# EAGLE design vvcc (EAGLE 9.6.2)

## Sheet 1 of 2
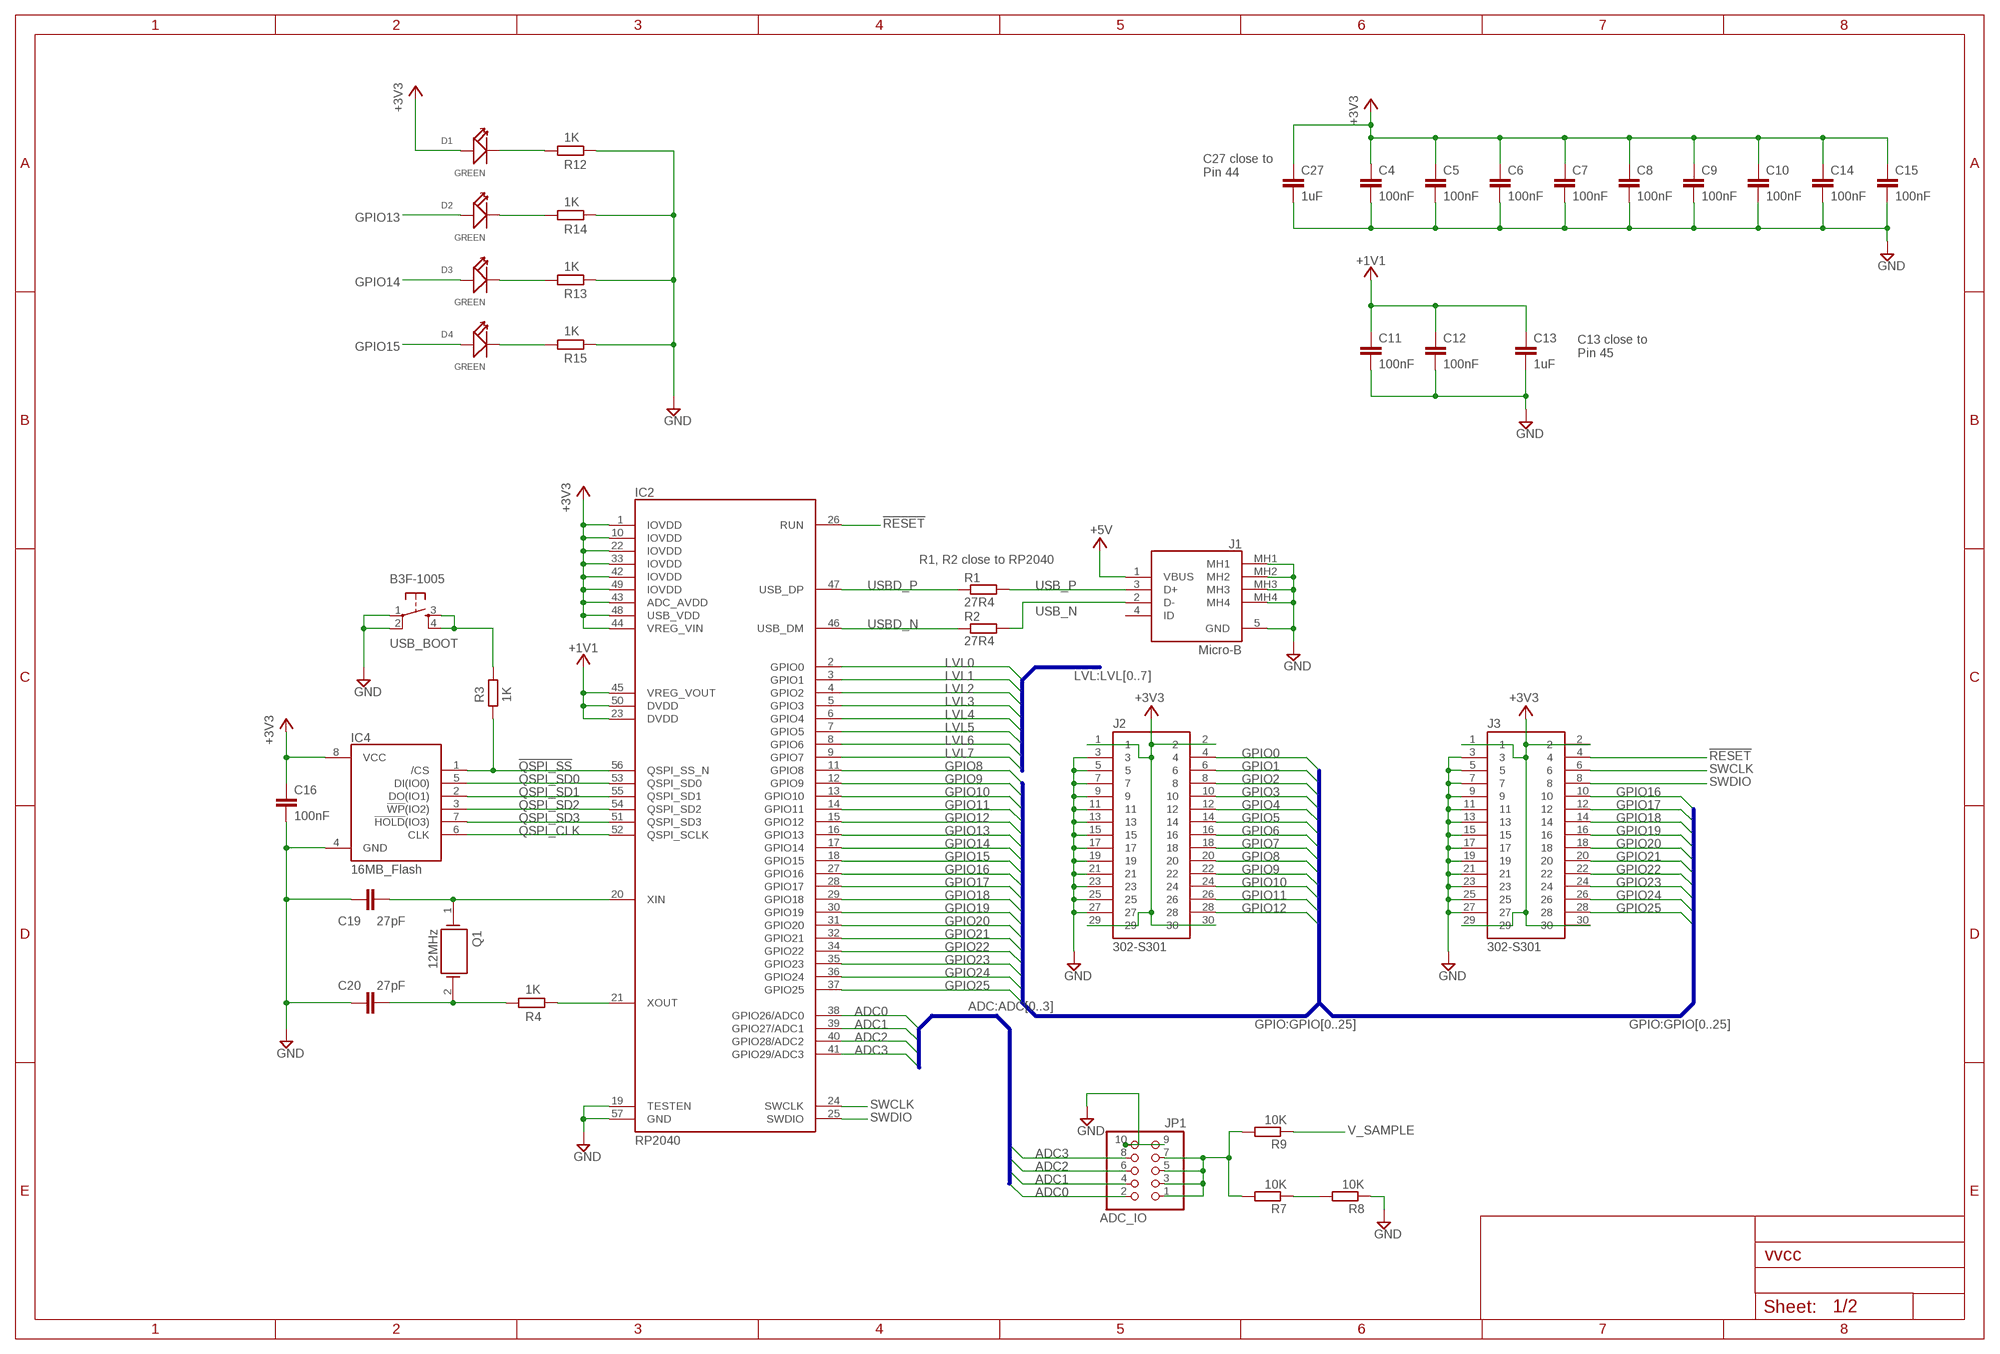
[diagram p0: schematic, sheet 1]

### Parts
C4  100nF  C-EUC0201  [C0201]
C5  100nF  C-EUC0201  [C0201]
C6  100nF  C-EUC0201  [C0201]
C7  100nF  C-EUC0201  [C0201]
C8  100nF  C-EUC0201  [C0201]
C9  100nF  C-EUC0201  [C0201]
C10  100nF  C-EUC0201  [C0201]
C11  100nF  C-EUC0201  [C0201]
C12  100nF  C-EUC0201  [C0201]
C13  1uF  C-EUC0201  [C0201]
C14  100nF  C-EUC0201  [C0201]
C15  100nF  C-EUC0201  [C0201]
C16  100nF  C-EUC0201  [C0201]
C19  27pF  C-EUC0201  [C0201]
C20  27pF  C-EUC0201  [C0201]
C27  1uF  C-EUC0201  [C0201]
D1  GREEN  SMD-LED-CLEAR-BLUE(0603)  [LED-0603]
D2  GREEN  SMD-LED-CLEAR-BLUE(0603)  [LED-0603]
D3  GREEN  SMD-LED-CLEAR-BLUE(0603)  [LED-0603]
D4  GREEN  SMD-LED-CLEAR-BLUE(0603)  [LED-0603]
IC2  RP2040  [QFN40P700X700X90-57N]
IC4  16MB_Flash  W25Q128JVSIM_TR  [SOIC127P790X216-8N]
J1  Micro-B  MCR-B-S-RA-SMT-CS14-T_R  [MCRBSRASMTCS14TR]
J2  302-S301  [SHDR30W66P254_2X15_4572X910X91]
J3  302-S301  [SHDR30W66P254_2X15_4572X910X91]
JP1  ADC_IO  PINHD-2X5  [2X05]
Q1  12MHz  ABLS-12.000MHZ-B4-T  [HC/49US-(AT49)_1]
R1  27R4  R-EU_R0201  [R0201]
R2  27R4  R-EU_R0201  [R0201]
R3  1K  R-EU_R0201  [R0201]
R4  1K  R-EU_R0201  [R0201]
R7  10K  R-EU_R0201  [R0201]
R8  10K  R-EU_R0201  [R0201]
R9  10K  R-EU_R0201  [R0201]
R12  1K  R-EU_R0201  [R0201]
R13  1K  R-EU_R0201  [R0201]
R14  1K  R-EU_R0201  [R0201]
R15  1K  R-EU_R0201  [R0201]
USB_BOOT  B3F-1005  TAC_SWITCHPTH  [TACTILE-PTH]

### Nets
!QSPI_SS!: IC2.56(QSPI_SS_N) IC4.1(/CS) R3.2
!RESET!: IC2.26(RUN) J3.4 ; also sheet 2
+1.8_FT: C11.1 C12.1 C13.1 IC2.23(DVDD) IC2.45(VREG_VOUT) IC2.50(DVDD) ; supply symbol labelled +1V1
+3V3: C4.1 C5.1 C6.1 C7.1 C8.1 C9.1 C10.1 C14.1 C15.1 C16.1 C27.1 D1.+ IC2.1(IOVDD) IC2.10(IOVDD) IC2.22(IOVDD) IC2.33(IOVDD) IC2.42(IOVDD) IC2.43(ADC_AVDD) IC2.44(VREG_VIN) IC2.48(USB_VDD) IC2.49(IOVDD) IC4.8(VCC) J2.1 J2.2 J2.29 J2.30 J3.1 J3.2 J3.29 J3.30 ; also sheet 2
+5V: J1.1(VBUS) ; also sheet 2
ADC0: IC2.38(GPIO26/ADC0) JP1.2
ADC1: IC2.39(GPIO27/ADC1) JP1.4
ADC2: IC2.40(GPIO28/ADC2) JP1.6
ADC3: IC2.41(GPIO29/ADC3) JP1.8
GND: C4.2 C5.2 C6.2 C7.2 C8.2 C9.2 C10.2 C11.2 C12.2 C13.2 C14.2 C15.2 C16.2 C19.2 C20.1 C27.2 IC2.19(TESTEN) IC2.57(GND) IC4.4(GND) J1.5(GND) J1.MH1 J1.MH2 J1.MH3 J1.MH4 J2.3 J2.5 J2.7 J2.9 J2.11 J2.13 J2.15 J2.17 J2.19 J2.21 J2.23 J2.25 J2.27 J3.3 J3.5 J3.7 J3.9 J3.11 J3.13 J3.15 J3.17 J3.19 J3.21 J3.23 J3.25 J3.27 JP1.9 JP1.10 R8.1 R12.2 R13.2 R14.2 R15.2 USB_BOOT.1 USB_BOOT.2 ; also sheet 2
GPIO0: J2.4 ; also sheet 2
GPIO1: J2.6 ; also sheet 2
GPIO2: J2.8 ; also sheet 2
GPIO3: J2.10 ; also sheet 2
GPIO4: J2.12 ; also sheet 2
GPIO5: J2.14 ; also sheet 2
GPIO6: J2.16 ; also sheet 2
GPIO7: J2.18 ; also sheet 2
GPIO8: IC2.11(GPIO8) J2.20 ; also sheet 2
GPIO9: IC2.12(GPIO9) J2.22 ; also sheet 2
GPIO10: IC2.13(GPIO10) J2.24
GPIO11: IC2.14(GPIO11) J2.26
GPIO12: IC2.15(GPIO12) J2.28 ; also sheet 2
GPIO13: D2.+ IC2.16(GPIO13) ; also sheet 2
GPIO14: D3.+ IC2.17(GPIO14)
GPIO15: D4.+ IC2.18(GPIO15)
GPIO16: IC2.27(GPIO16) J3.10
GPIO17: IC2.28(GPIO17) J3.12
GPIO18: IC2.29(GPIO18) J3.14
GPIO19: IC2.30(GPIO19) J3.16
GPIO20: IC2.31(GPIO20) J3.18
GPIO21: IC2.32(GPIO21) J3.20
GPIO22: IC2.34(GPIO22) J3.22
GPIO23: IC2.35(GPIO23) J3.24
GPIO24: IC2.36(GPIO24) J3.26
GPIO25: IC2.37(GPIO25) J3.28
LVL0: IC2.2(GPIO0) ; also sheet 2
LVL1: IC2.3(GPIO1) ; also sheet 2
LVL2: IC2.4(GPIO2) ; also sheet 2
LVL3: IC2.5(GPIO3) ; also sheet 2
LVL4: IC2.6(GPIO4) ; also sheet 2
LVL5: IC2.7(GPIO5) ; also sheet 2
LVL6: IC2.8(GPIO6) ; also sheet 2
LVL7: IC2.9(GPIO7) ; also sheet 2
N$1: C19.1 IC2.20(XIN) Q1.1
N$2: C20.2 Q1.2 R4.1
N$3: D1.- R12.1
N$4: D2.- R14.1
N$5: R3.1 USB_BOOT.3 USB_BOOT.4
N$6: D3.- R13.1
N$7: IC2.21(XOUT) R4.2
N$8: D4.- R15.1
N$9: JP1.1 JP1.3 JP1.5 JP1.7 R7.2 R9.2
N$11: R7.1 R8.2
QSPI_CLK: IC2.52(QSPI_SCLK) IC4.6(CLK)
QSPI_SD0: IC2.53(QSPI_SD0) IC4.5(DI(IO0))
QSPI_SD1: IC2.55(QSPI_SD1) IC4.2(DO(IO1))
QSPI_SD2: IC2.54(QSPI_SD2) IC4.3(!WP!(IO2))
QSPI_SD3: IC2.51(QSPI_SD3) IC4.7(!HOLD!(IO3))
SWCLK: IC2.24(SWCLK) J3.6
SWDIO: IC2.25(SWDIO) J3.8
USB_N [USB]: J1.2(D-) R2.2
USB_P [USB]: J1.3(D+) R1.2
USBD_N: IC2.46(USB_DM) R2.1
USBD_P: IC2.47(USB_DP) R1.1
V_SAMPLE: R9.1 ; also sheet 2
Unconnected: J1.4(ID)

### Buses
GPIO:GPIO[0..25]
ADC:ADC[0..3]
LVL:LVL[0..7]

### Notes on the sheet
- C27 close to
  Pin 44
- C13 close to
  Pin 45
- R1, R2 close to RP2040

## Sheet 2 of 2
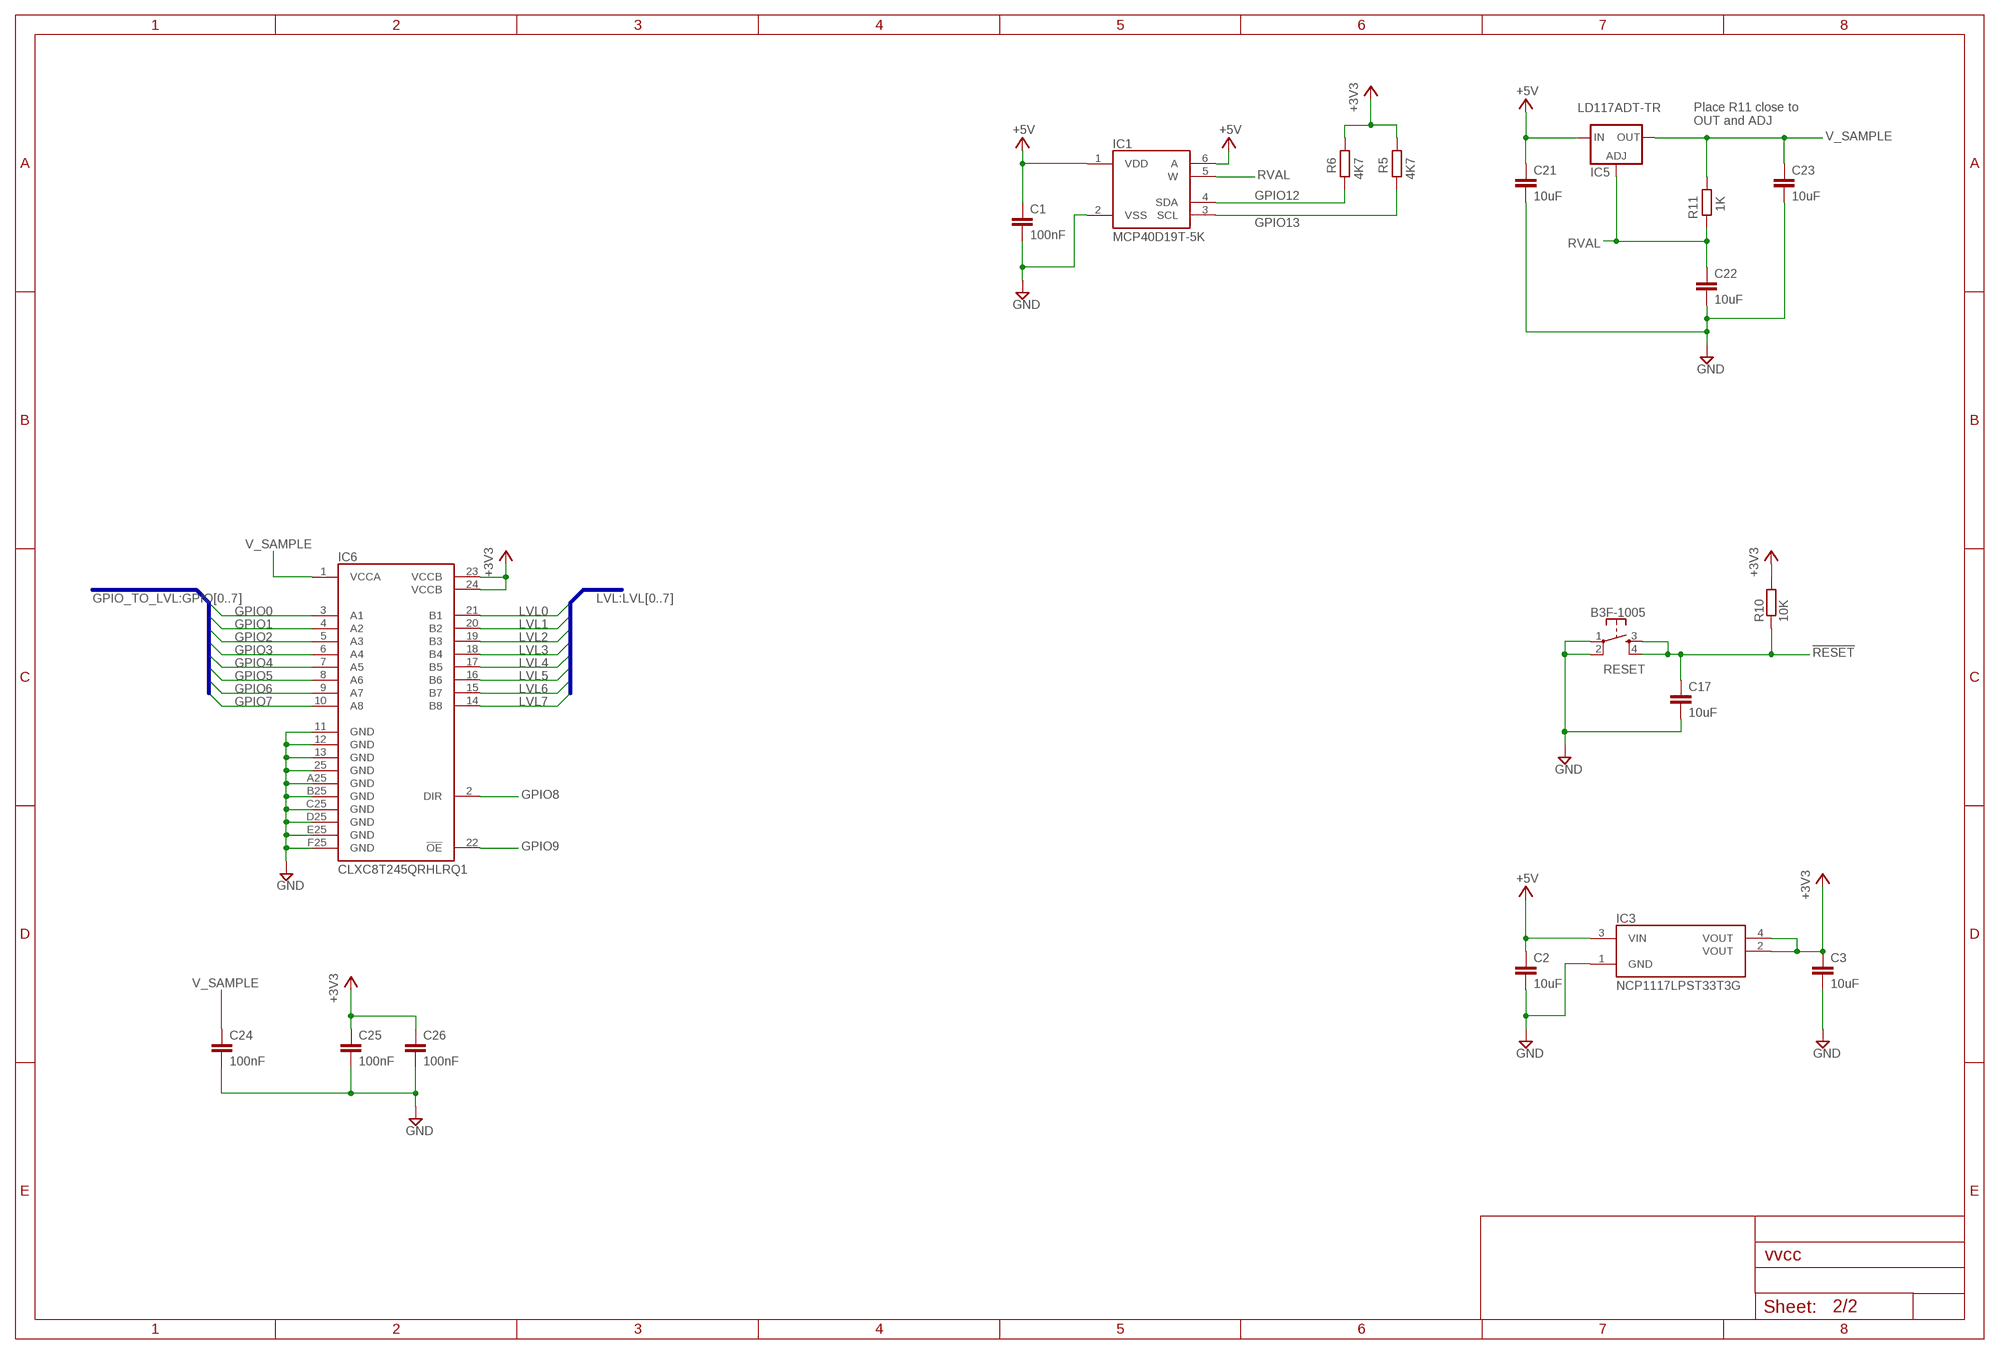
[diagram p1: schematic, sheet 2]

### Parts
C1  100nF  C-EUC0201  [C0201]
C2  10uF  C-EUC0402  [C0402]
C3  10uF  C-EUC0402  [C0402]
C17  10uF  C-EUC0402  [C0402]
C21  10uF  C-EUC0402  [C0402]
C22  10uF  C-EUC0402  [C0402]
C23  10uF  C-EUC0402  [C0402]
C24  100nF  C-EUC0201  [C0201]
C25  100nF  C-EUC0201  [C0201]
C26  100nF  C-EUC0201  [C0201]
IC1  MCP40D19T-5K  MCP40D18T-104E_LT  [SOP65P210X110-6N]
IC3  NCP1117LPST33T3G  [SOT230P700X180-4N]
IC5  LD117ADT-TR  [DPACK]
IC6  CLXC8T245QRHLRQ1  [CLXC8T245QRHLRQ1]
R5  4K7  R-EU_R0201  [R0201]
R6  4K7  R-EU_R0201  [R0201]
R10  10K  R-EU_R0201  [R0201]
R11  1K  R-EU_R0201  [R0201]
RESET  B3F-1005  TAC_SWITCHPTH  [TACTILE-PTH]

### Nets
!RESET!: C17.1 R10.1 RESET.3 RESET.4 ; also sheet 1
+3V3: C3.1 C25.1 C26.1 IC3.2(VOUT) IC3.4(VOUT) IC6.23(VCCB) IC6.24(VCCB) R5.1 R6.1 R10.2 ; also sheet 1
+5V: C1.1 C2.1 C21.1 IC1.1(VDD) IC1.6(A) IC3.3(VIN) IC5.3(IN) ; also sheet 1
GND: C1.2 C2.2 C3.2 C17.2 C21.2 C22.2 C23.2 C24.2 C25.2 C26.2 IC1.2(VSS) IC3.1(GND) IC6.11(GND) IC6.12(GND) IC6.13(GND) IC6.25(GND) IC6.A25(GND) IC6.B25(GND) IC6.C25(GND) IC6.D25(GND) IC6.E25(GND) IC6.F25(GND) RESET.1 RESET.2 ; also sheet 1
GPIO0: IC6.3(A1) ; also sheet 1
GPIO1: IC6.4(A2) ; also sheet 1
GPIO2: IC6.5(A3) ; also sheet 1
GPIO3: IC6.6(A4) ; also sheet 1
GPIO4: IC6.7(A5) ; also sheet 1
GPIO5: IC6.8(A6) ; also sheet 1
GPIO6: IC6.9(A7) ; also sheet 1
GPIO7: IC6.10(A8) ; also sheet 1
GPIO8: IC6.2(DIR) ; also sheet 1
GPIO9: IC6.22(!OE) ; also sheet 1
GPIO12: IC1.4(SDA) R6.2 ; also sheet 1
GPIO13: IC1.3(SCL) R5.2 ; also sheet 1
LVL0: IC6.21(B1) ; also sheet 1
LVL1: IC6.20(B2) ; also sheet 1
LVL2: IC6.19(B3) ; also sheet 1
LVL3: IC6.18(B4) ; also sheet 1
LVL4: IC6.17(B5) ; also sheet 1
LVL5: IC6.16(B6) ; also sheet 1
LVL6: IC6.15(B7) ; also sheet 1
LVL7: IC6.14(B8) ; also sheet 1
RVAL: C22.1 IC1.5(W) IC5.1(ADJ) R11.2
V_SAMPLE: C23.1 C24.1 IC5.4(OUT) IC6.1(VCCA) R11.1 ; also sheet 1

### Buses
GPIO_TO_LVL:GPIO[0..7]
LVL:LVL[0..7]

### Notes on the sheet
- Place R11 close to
  OUT and ADJ

## Library data of the parts
C1 C4-C12 C14-C16 C24-C26 = rcl:C-EU: CAPACITOR, European symbol; SPICEPREFIX: C; USE: 0201X104M160CT
C2 C3 C17 C21-C23 = rcl:C-EU: CAPACITOR, European symbol; SPICEPREFIX: C; USE: GRM155R60J106ME15D
C13 C27 = rcl:C-EU: CAPACITOR, European symbol; SPICEPREFIX: C; USE: 0201B102K250CT
C19 C20 = rcl:C-EU: CAPACITOR, European symbol; SPICEPREFIX: C; USE: C0201C270J3GAC7867
D1-D4 = Seeed-LED:SMD-LED-CLEAR-BLUE(0603): 304090045; MPN: 19-217-BHC-ZL1M2RY-3T; USE: B1931NG--20D001114U1930; VALUE: BLUE-0603
IC1 = samacsys:MCP40D18T-104E_LT: MCP40D18T-104E/LT, Digital Potentiometer 100k 128-Position Linear Serial-I2C 6-Pin SC-70 Source: Datasheet <https://componentsearchengine.com/Datasheets/2/MCP40D18T-104E_LT.pdf>; ARROW_PART_NUMBER: MCP40D18T-104E/LT; ARROW_PRICE-STOCK: https://www.arrow.com/en/products/mcp40d18t-104elt/microchip-technology?region=nac; DESCRIPTION: MCP40D18T-104E/LT, Digital Potentiometer 100k 128-Position Linear Serial-I2C 6-Pin SC-70; HEIGHT: 1.1mm; MANUFACTURER_NAME: Microchip; MANUFACTURER_PART_NUMBER: MCP40D18T-104E/LT; MOUSER_PART_NUMBER: 579-MCP40D18T104E/LT; MOUSER_PRICE-STOCK: https://www.mouser.co.uk/ProductDetail/Microchip-Technology/MCP40D18T-104E-LT?qs=dQMF8gqycOWA9kQDYIYtyg%3D%3D; USE: MCP4019T-502E/LT
IC2 = samacsys:RP2040: Microcontroller in QFN Package Source: Datasheet <https://datasheets.raspberrypi.org/rp2040/rp2040-datasheet.pdf>; DESCRIPTION: Microcontroller in QFN Package; HEIGHT: 0.9mm; MANUFACTURER_NAME: RASPBERRY-PI; MANUFACTURER_PART_NUMBER: RP2040; USE: SC0914(13)
IC3 = samacsys:NCP1117LPST33T3G: ON SEMICONDUCTOR - NCP1117LPST33T3G - Fixed LDO Voltage Regulator, 18V in, 1.3V Dropout, 3.3V/1A out, SOT-223-3 Source: Datasheet <http://www.onsemi.com/pub/Collateral/NCP1117LP-D.PDF>; ARROW_PART_NUMBER: NCP1117LPST33T3G; ARROW_PRICE-STOCK: https://www.arrow.com/en/products/ncp1117lpst33t3g/on-semiconductor?region=nac; DESCRIPTION: ON SEMICONDUCTOR - NCP1117LPST33T3G - Fixed LDO Voltage Regulator, 18V in, 1.3V Dropout, 3.3V/1A out, SOT-223-3; HEIGHT: 1.8mm; MANUFACTURER_NAME: ON Semiconductor; MANUFACTURER_PART_NUMBER: NCP1117LPST33T3G; MOUSER_PART_NUMBER: 863-NCP1117LPST33T3G; MOUSER_PRICE-STOCK: https://www.mouser.co.uk/ProductDetail/onsemi/NCP1117LPST33T3G?qs=kbSN2QblFfKG9A4Foh4YYg%3D%3D; USE: NCP1117LPST33T3G
IC4 = samacsys:W25Q128JVSIM_TR: 3V 128M-BIT SERIAL FLASH MEMORY WITH DUAL/QUAD SPI & QPI & DTR Source: Datasheet <http://www.winbond.com/resource-files/w25q128jv dtr revb 11042016.pdf>; ARROW_PART_NUMBER: W25Q128JVSIM TR; ARROW_PRICE-STOCK: https://www.arrow.com/en/products/w25q128jvsimtr/winbond-electronics?region=nac; DESCRIPTION: 3V 128M-BIT SERIAL FLASH MEMORY WITH DUAL/QUAD SPI & QPI & DTR; HEIGHT: 2.16mm; MANUFACTURER_NAME: Winbond; MANUFACTURER_PART_NUMBER: W25Q128JVSIM TR; MOUSER_PART_NUMBER: 454-W25Q128JVSIMTR; MOUSER_PRICE-STOCK: https://www.mouser.co.uk/ProductDetail/Winbond/W25Q128JVSIM-TR?qs=qSfuJ%252Bfl%2Fd6ji9IuruL6Zg%3D%3D; USE: W25Q128JVSIM
IC5 = v-reg:LD117A?*: Low drop fixed and adjustable positive voltage regulators 1 A Source: http://www.st.com/stonline/products/literature/ds/7194/ld1117axx.pdf; USE: LD1117ADT-TR
IC6 = samacsys:CLXC8T245QRHLRQ1: Translation - Voltage Levels Automotive 8-bit dual-supply wide voltage level translating transceiver with tri-state output Source: Datasheet <https://www.ti.com/lit/ds/symlink/sn74lxc8t245-q1.pdf?ts=1613201124833&ref_url=https%3A%2F%2Fwww.ti.com%2Fproduct%2FSN74LXC8T245-Q1>; ARROW_PART_NUMBER: CLXC8T245QRHLRQ1; ARROW_PRICE-STOCK: https://www.arrow.com/en/products/clxc8t245qrhlrq1/texas-instruments?region=nac; DESCRIPTION: Translation - Voltage Levels Automotive 8-bit dual-supply wide voltage level translating transceiver with tri-state output; HEIGHT: 1mm; MANUFACTURER_NAME: Texas Instruments; MANUFACTURER_PART_NUMBER: CLXC8T245QRHLRQ1; MOUSER_PART_NUMBER: 595-CLXC8T245QRHLRQ1; MOUSER_PRICE-STOCK: https://www.mouser.co.uk/ProductDetail/Texas-Instruments/CLXC8T245QRHLRQ1?qs=81r%252BiQLm7BTun0cHFvM3vA%3D%3D; USE: CLXC8T245QRHLRQ1
J1 = samacsys:MCR-B-S-RA-SMT-CS14-T_R: USB - micro B Receptacle Connector 5 Position Surface Mount, Right Angle Source: Datasheet <https://app.adam-tech.com/products/download/data_sheet/195344/mcr-b-s-ra-smt-cs14-t-r-data-sheet.pdf>; ARROW_PART_NUMBER: MCR-B-S-RA-SMT-CS14-T/R; ARROW_PRICE-STOCK: https://www.arrow.com/en/products/mcr-b-s-ra-smt-cs14-tr/adam-tech?region=nac; DESCRIPTION: USB - micro B Receptacle Connector 5 Position Surface Mount, Right Angle; HEIGHT: 3.1mm; MANUFACTURER_NAME: Adam Tech; MANUFACTURER_PART_NUMBER: MCR-B-S-RA-SMT-CS14-T/R; USE: MCR-B-S-RA-SMT-CS14-T_R
J2 J3 = samacsys:302-S301: Dual row vertical box header Source: Datasheet <https://datasheet.datasheetarchive.com/originals/dk/DKDS-18/336341.pdf>; ARROW_PART_NUMBER: 302-S301; ARROW_PRICE-STOCK: https://www.arrow.com/en/products/302-s301/on-shore-technology; DESCRIPTION: Dual row vertical box header; HEIGHT: 9.1mm; MANUFACTURER_NAME: On-Shore Technology, Inc; MANUFACTURER_PART_NUMBER: 302-S301; USE: 302-S301
JP1 = pinhead:PINHD-2X5: PIN HEADER; USE: PR20205VBDN
Q1 = samacsys:ABLS-12.000MHZ-B4-T: ABRACON - ABLS-12.000MHZ-B4-T - CRYSTAL, 12MHZ, 18PF, HC-49US Source: Datasheet <https://componentsearchengine.com/Datasheets/2/ABLS-12.000MHZ-B4-T.pdf>; ARROW_PART_NUMBER: ABLS-12.000MHZ-B4-T; ARROW_PRICE-STOCK: https://www.arrow.com/en/products/abls-12.000mhz-b4-t/abracon?region=nac; DESCRIPTION: ABRACON - ABLS-12.000MHZ-B4-T - CRYSTAL, 12MHZ, 18PF, HC-49US; HEIGHT: mm; MANUFACTURER_NAME: ABRACON; MANUFACTURER_PART_NUMBER: ABLS-12.000MHZ-B4-T; MOUSER_PART_NUMBER: 815-ABLS-12.0M-T; MOUSER_PRICE-STOCK: https://www.mouser.co.uk/ProductDetail/ABRACON/ABLS-12000MHZ-B4-T?qs=yTU0IcKoRlGSQ8ooxPPVnQ%3D%3D; USE: ABLS-12.000MHZ-B4-T
R1 R2 = rcl:R-EU_: RESISTOR, European symbol; SPICEPREFIX: R; USE: RC0201FR-0727R4L
R3 R4 R11-R15 = rcl:R-EU_: RESISTOR, European symbol; SPICEPREFIX: R; USE: RC0201FR-071KL
R5 R6 = rcl:R-EU_: RESISTOR, European symbol; SPICEPREFIX: R; USE: ERJ-1GNJ472C
R7-R10 = rcl:R-EU_: RESISTOR, European symbol; SPICEPREFIX: R; USE: CR0201-JW-103GLF
RESET USB_BOOT = SparkFun:TAC_SWITCH: Momentary Switch Button commonly used for reset or general input. Spark Fun Electronics SKU : COM-00097; USE: B3F-1005

## Net classes
1 USB: width 0.229 mm, clearance 0.305 mm to class 0, clearance 0.152 mm

## Board
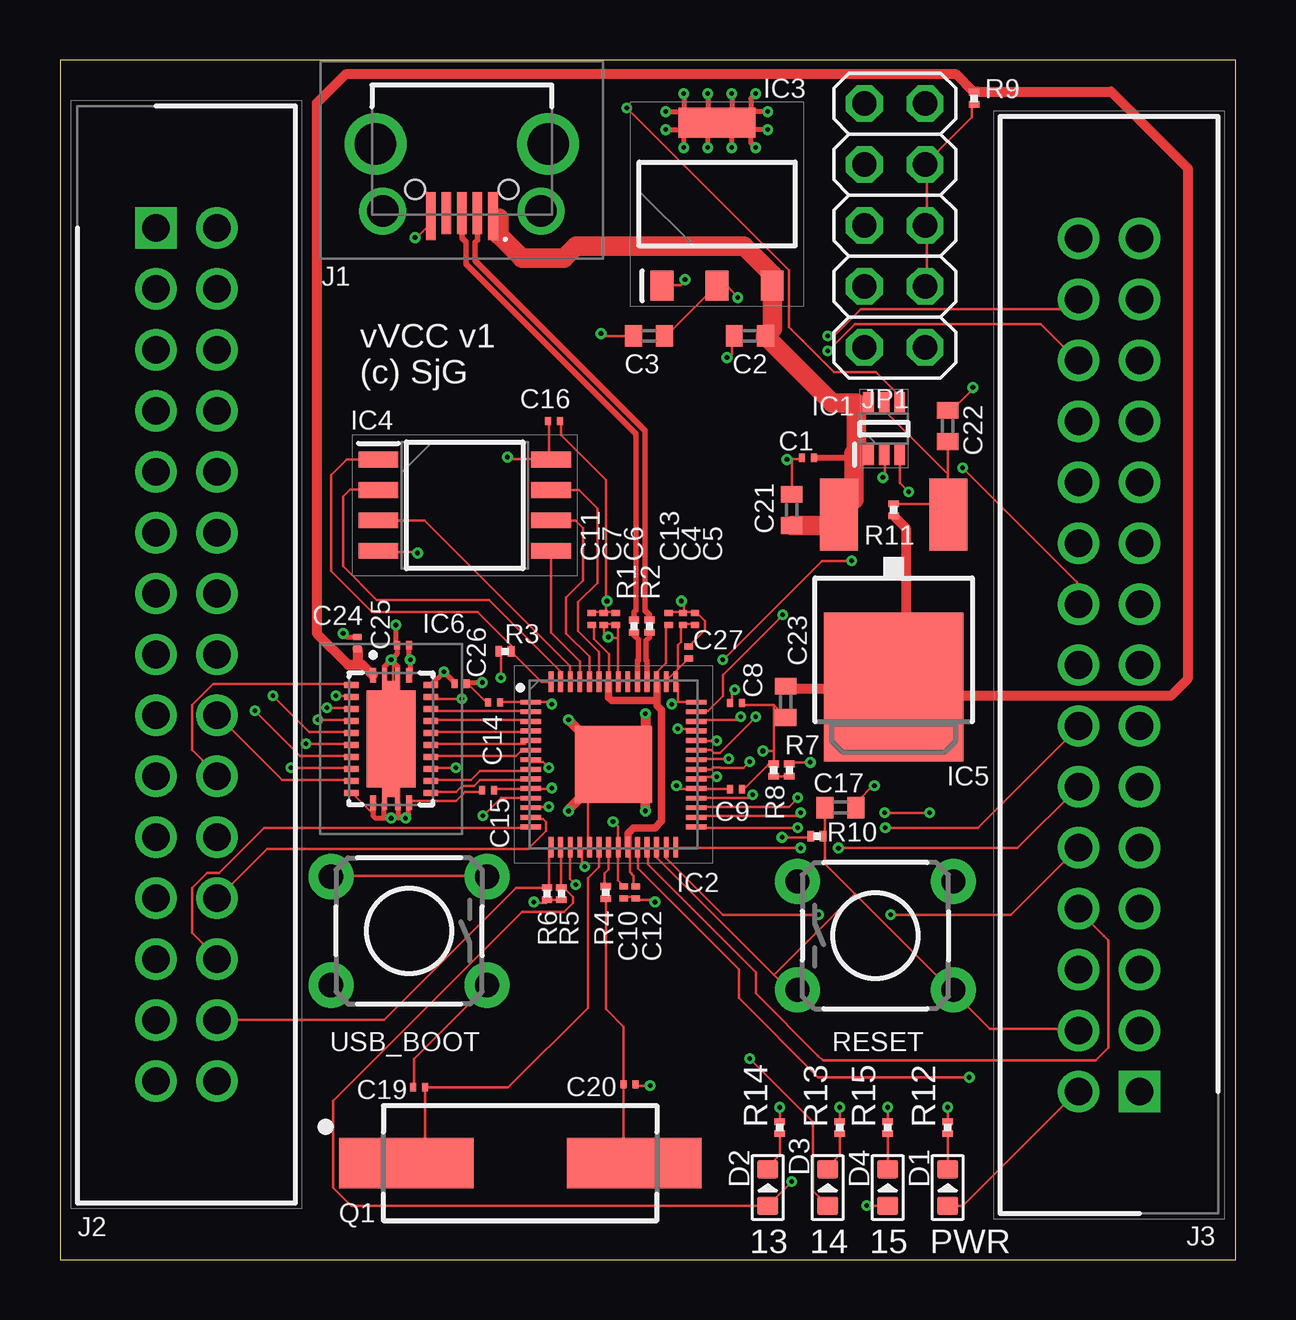
[diagram p2: board, top side]
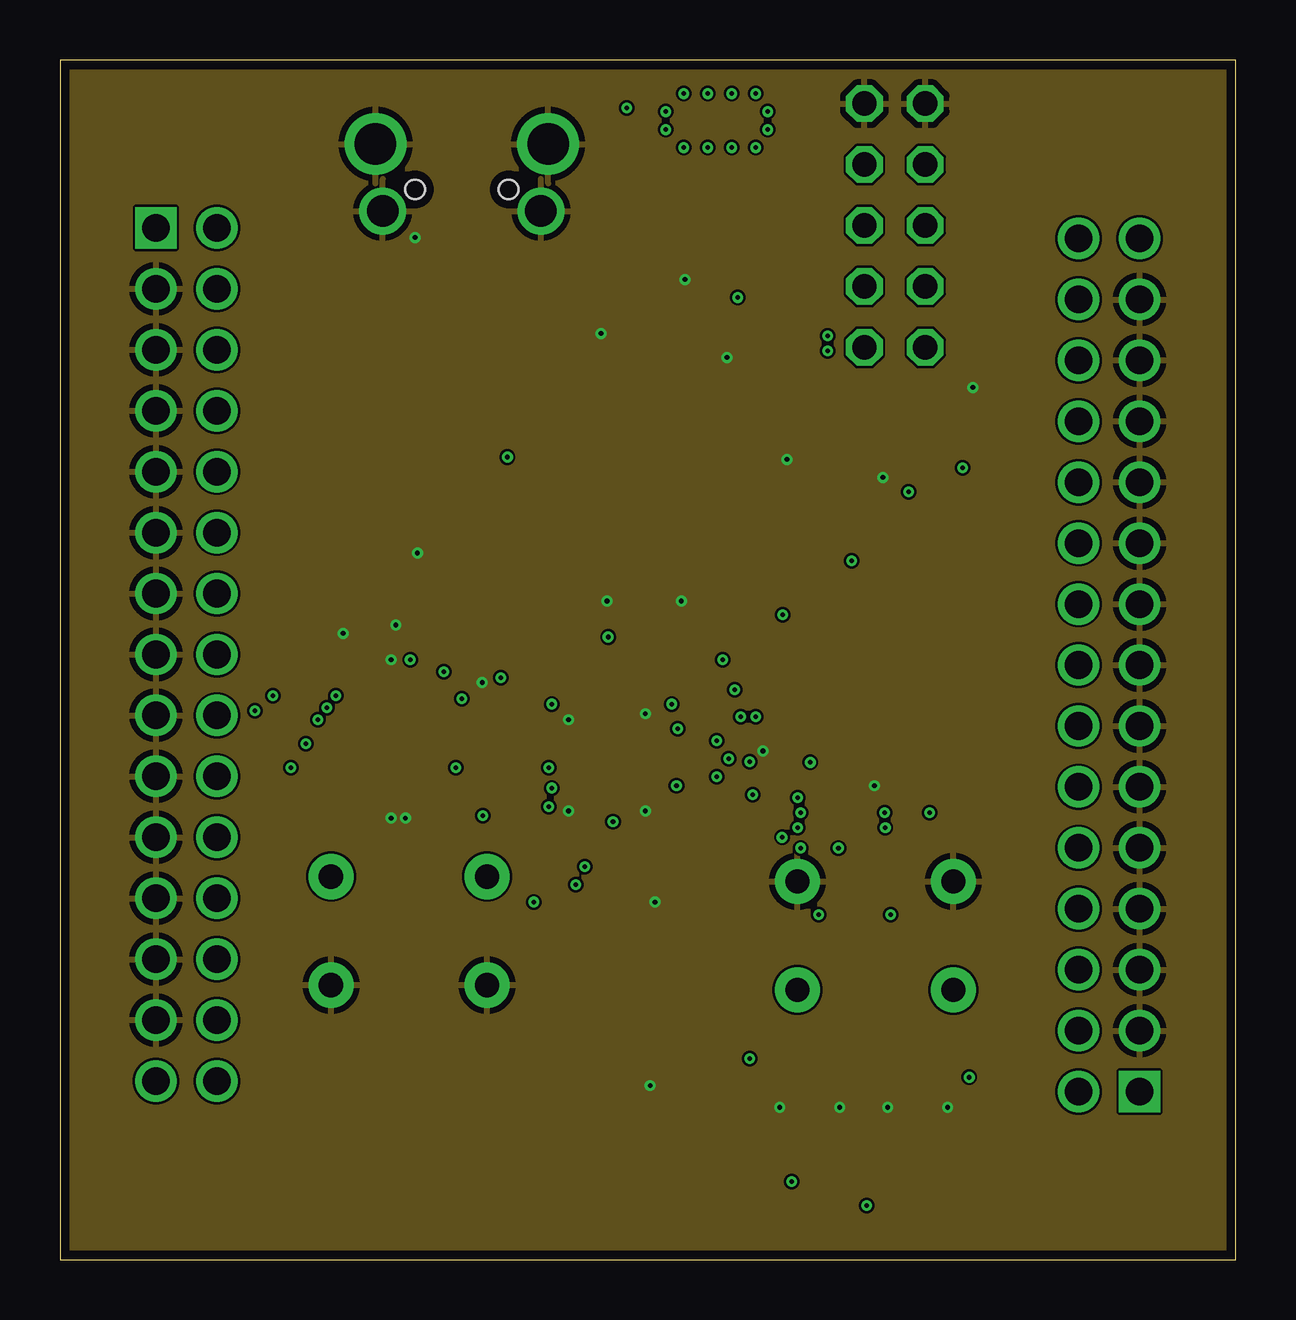
[diagram p3: board, inner layer Route2]
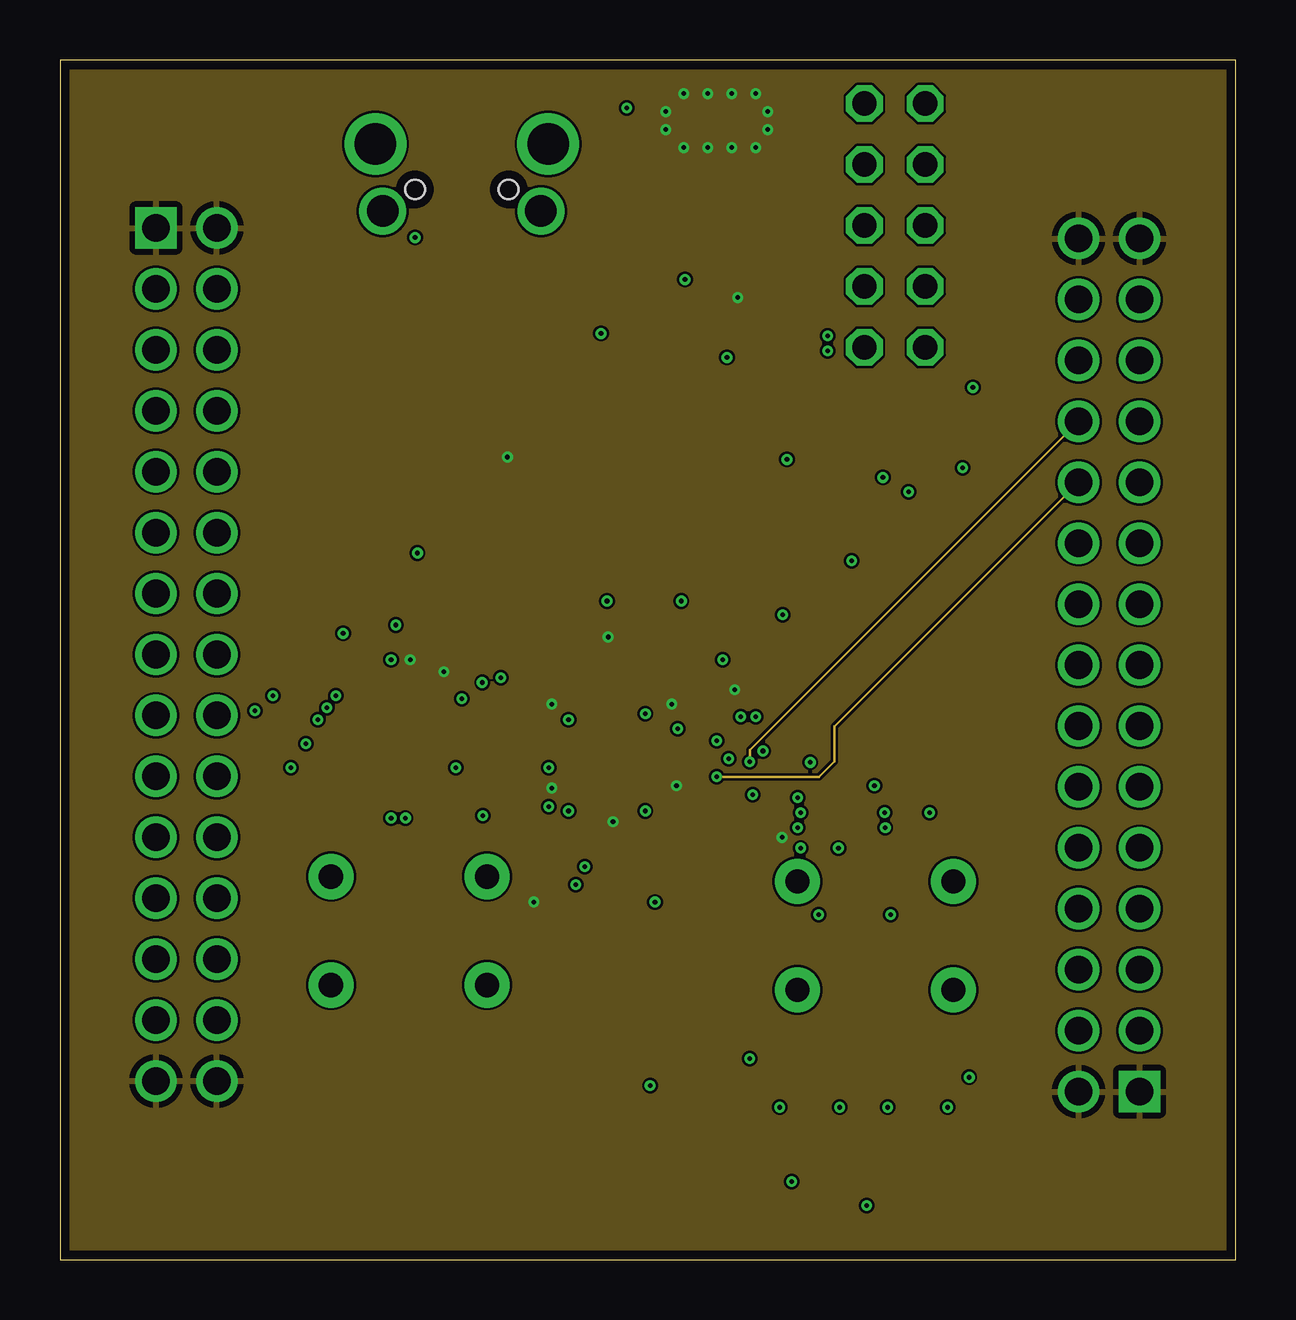
[diagram p4: board, inner layer Route15]
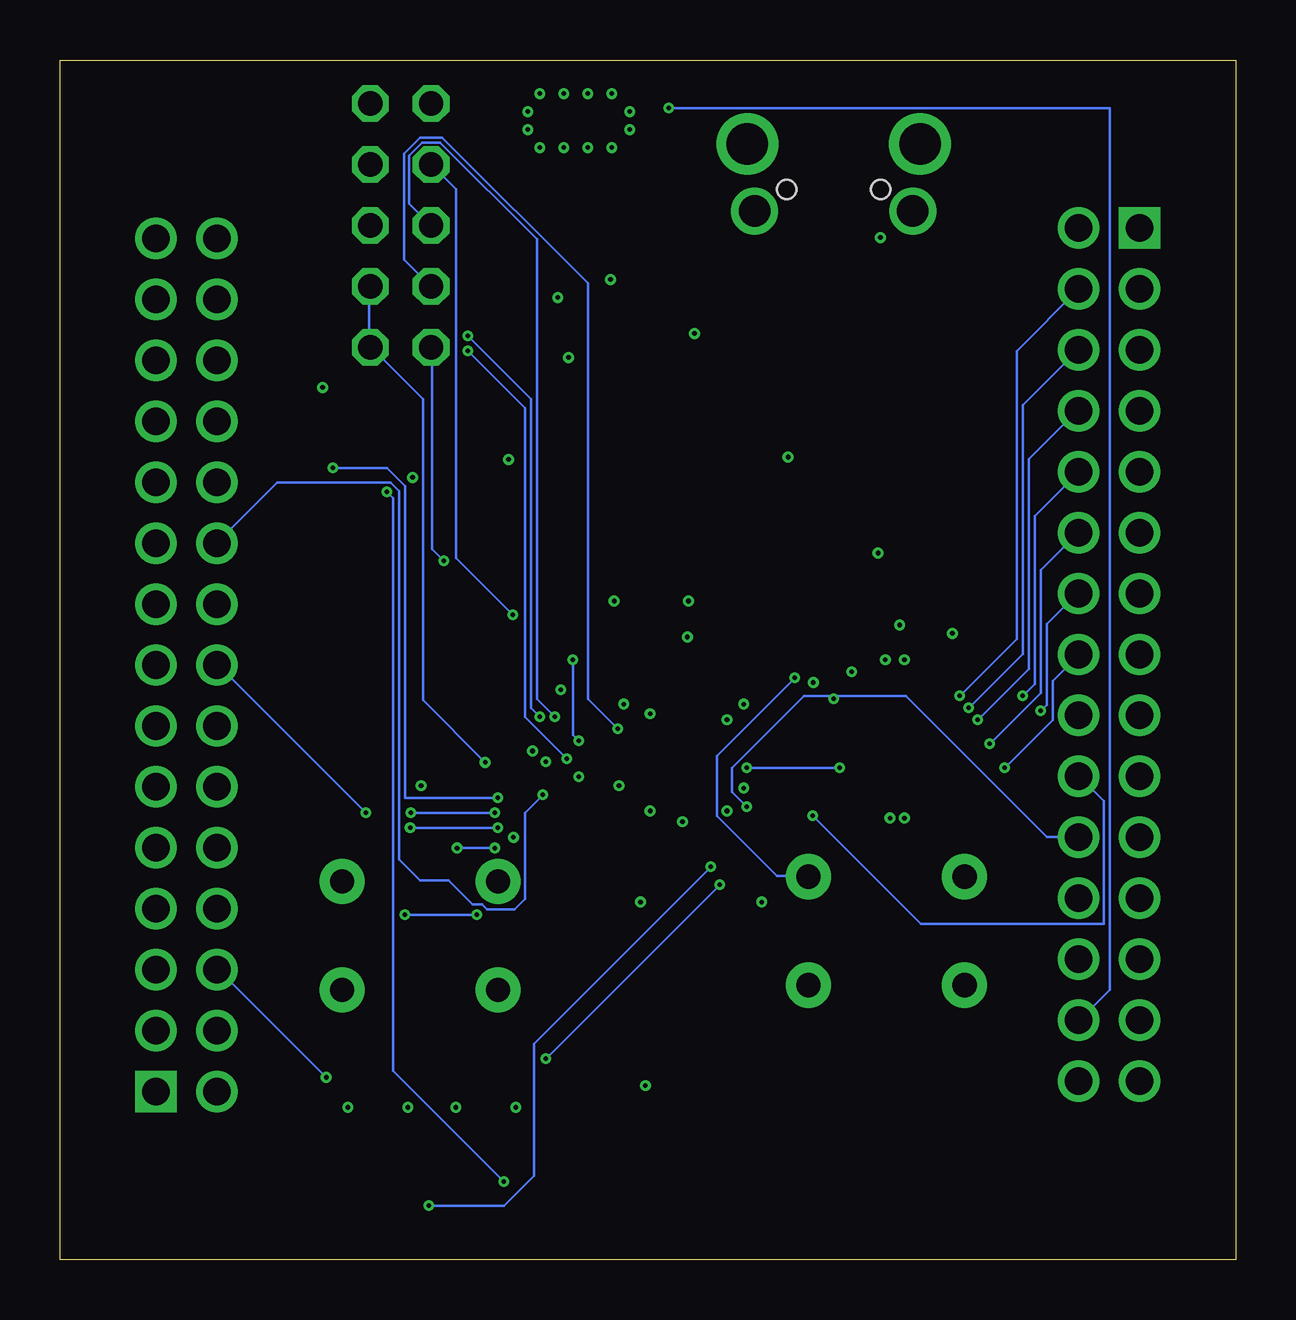
[diagram p5: board, bottom side, seen from below]

Size 49 x 50 mm. Coordinates in mm from the lower left corner, seen from the top.
Outline: 0,0 49,0 49,50 0,50 0,0
Copper layers (1+2*15+16): Top 0.035mm / dielectric 1.5mm / Route2 0.035mm / dielectric 0.15mm / Route15 0.035mm / dielectric 0.2mm / Bottom 0.035mm
Design rules "nextpbc-4mil *": minimum track width 4mil, minimum drill 0.2mm, track to track 4mil, track to pad 4mil, pad to pad 4mil, via to via 4mil, smd to smd 4mil, copper to edge 15mil, drill to drill 5mil, minimum pad ring 5mil, minimum via ring 5mil, stop-mask expansion 4mil, vias tented up to drill 0mil, thermal gap 10mil
bRestrict: area 23.8,23.8 to 24.8,34.8; 8 lines

### Footprints (pad centres in the part's own frame; a part is rotated, then mirrored left to right if it is on the bottom)
C0201 = smd 0.25 x 0.35: 1 -0.25,0; 2 0.25,0
C0402 = smd 0.7 x 0.9: 1 -0.65,0; 2 0.65,0
LED-0603 = smd 0.762 x 0.889: + -0.762,0; - 0.762,0
SOP65P210X110-6N = smd 0.9 x 0.45: 1 -1.075,0.65; 2 -1.075,0; 3 -1.075,-0.65; 4 1.075,-0.65; 5 1.075,0; 6 1.075,0.65
QFN40P700X700X90-57N = smd 0.85 x 0.2: 1 -3.45,2.6; 2 -3.45,2.2; 3 -3.45,1.8; 4 -3.45,1.4; 5 -3.45,1; 6 -3.45,0.6; 7 -3.45,0.2; 8 -3.45,-0.2; 9 -3.45,-0.6; 10 -3.45,-1; 11 -3.45,-1.4; 12 -3.45,-1.8; 13 -3.45,-2.2; 14 -3.45,-2.6; 29 3.45,-2.6; 30 3.45,-2.2; 31 3.45,-1.8; 32 3.45,-1.4; 33 3.45,-1; 34 3.45,-0.6; 35 3.45,-0.2; 36 3.45,0.2; 37 3.45,0.6; 38 3.45,1; 39 3.45,1.4; 40 3.45,1.8; 41 3.45,2.2; 42 3.45,2.6 | smd 0.2 x 0.85: 15 -2.6,-3.45; 16 -2.2,-3.45; 17 -1.8,-3.45; 18 -1.4,-3.45; 19 -1,-3.45; 20 -0.6,-3.45; 21 -0.2,-3.45; 22 0.2,-3.45; 23 0.6,-3.45; 24 1,-3.45; 25 1.4,-3.45; 26 1.8,-3.45; 27 2.2,-3.45; 28 2.6,-3.45; 43 2.6,3.45; 44 2.2,3.45; 45 1.8,3.45; 46 1.4,3.45; 47 1,3.45; 48 0.6,3.45; 49 0.2,3.45; 50 -0.2,3.45; 51 -0.6,3.45; 52 -1,3.45; 53 -1.4,3.45; 54 -1.8,3.45; 55 -2.2,3.45; 56 -2.6,3.45 | smd 3.2 x 3.2: 57 0,0
SOT230P700X180-4N = smd 1.25 x 0.95: 1 -3.4,2.3; 2 -3.4,0; 3 -3.4,-2.3 | smd 1.25 x 3.2: 4 3.4,0
SOIC127P790X216-8N = smd 1.65 x 0.65: 1 -3.6,1.905; 2 -3.6,0.635; 3 -3.6,-0.635; 4 -3.6,-1.905; 5 3.6,-1.905; 6 3.6,-0.635; 7 3.6,0.635; 8 3.6,1.905
DPACK = smd 1.6 x 3: 1 -2.28,-4.8; 3 2.28,-4.8 | smd 5.8 x 6.2: 4 0,2.38
CLXC8T245QRHLRQ1 = smd 0.24 x 0.6: 1 -0.75,2.65; 12 -0.75,-2.65; 13 0.75,-2.65; 24 0.75,2.65 | smd 0.6 x 0.24: 2 -1.65,2.25; 3 -1.65,1.75; 4 -1.65,1.25; 5 -1.65,0.75; 6 -1.65,0.25; 7 -1.65,-0.25; 8 -1.65,-0.75; 9 -1.65,-1.25; 10 -1.65,-1.75; 11 -1.65,-2.25; 14 1.65,-2.25; 15 1.65,-1.75; 16 1.65,-1.25; 17 1.65,-0.75; 18 1.65,-0.25; 19 1.65,0.25; 20 1.65,0.75; 21 1.65,1.25; 22 1.65,1.75; 23 1.65,2.25 | smd 2.05 x 4.05: 25 0,0 | smd 0.75 x 0.4: A25 0,2.225; B25 0,-2.225 | smd 0.2 x 0.525: C25 -0.275,2.688; D25 0.275,2.688; E25 -0.275,-2.688; F25 0.275,-2.688
MCRBSRASMTCS14TR = smd 0.4 x 2: 1 -1.3,2.75; 5 1.3,2.75 | smd 0.4 x 1.75: 2 -0.65,2.625; 3 0,2.625; 4 0.65,2.625 | drill 1.31 pad 1.965: MH1 -3.3,2.55; MH4 3.3,2.55 | drill 1.72 pad 2.58: MH2 -3.6,-0.25; MH3 3.6,-0.25 | hole 0.8: -1.95,1.65; 1.95,1.65
SHDR30W66P254_2X15_4572X910X91 = drill 1.15 pad 1.725 square: 1 0,0 | drill 1.15 pad 1.725: 2 0,2.54; 3 2.54,0; 4 2.54,2.54; 5 5.08,0; 6 5.08,2.54; 7 7.62,0; 8 7.62,2.54; 9 10.16,0; 10 10.16,2.54; 11 12.7,0; 12 12.7,2.54; 13 15.24,0; 14 15.24,2.54; 15 17.78,0; 16 17.78,2.54; 17 20.32,0; 18 20.32,2.54; 19 22.86,0; 20 22.86,2.54; 21 25.4,0; 22 25.4,2.54; 23 27.94,0; 24 27.94,2.54; 25 30.48,0; 26 30.48,2.54; 27 33.02,0; 28 33.02,2.54; 29 35.56,0; 30 35.56,2.54
2X05 = drill 1.016 octagon: 1 -5.08,-1.27; 2 -5.08,1.27; 3 -2.54,-1.27; 4 -2.54,1.27; 5 0,-1.27; 6 0,1.27; 7 2.54,-1.27; 8 2.54,1.27; 9 5.08,-1.27; 10 5.08,1.27
HC/49US-(AT49)_1 = smd 5.6 x 2.1: 1 -4.75,0; 2 4.75,0
R0201 = smd 0.28 x 0.43: 1 -0.255,0; 2 0.255,0
TACTILE-PTH = drill 1.016 pad 1.88: 1 -3.251,2.261; 2 3.251,2.261; 3 -3.251,-2.261; 4 3.251,-2.261

### Placement (x,y rotation side)
C1  31.17,33.41 180 top
C2  28.75,38.5 180 top
C3  24.55,38.5 180 top
C4  25.97,26.7 90 top
C5  26.47,26.7 90 top
C6  23.17,26.7 90 top
C7  22.67,26.7 90 top
C8  28.17,23.2 0 top
C9  28.17,19.6 0 top
C10  23.5,15.3 270 top
C11  22.17,26.7 90 top
C12  24,15.3 270 top
C13  25.37,26.7 90 top
C14  18.09,23.22 180 top
C15  17.84,19.56 180 top
C16  20.6,34.95 0 top
C17  32.53,18.84 0 top
C19  14.96,7.18 180 top
C20  23.74,7.3 180 top
C21  30.5,31.25 90 top
C22  37,34.75 90 top
C23  30.25,23.25 270 top
C24  12.4,25.7 90 top
C25  14.3,25.6 180 top
C26  16.7,24 0 top
C27  26.2,25.3 90 top
D1  37,3 90 top
D2  29.5,3 90 top
D3  32,3 90 top
D4  34.5,3 90 top
IC1  34.35,34.63 90 top
IC2  23.07,20.63 0 top
IC3  27.39,43.99 90 top
IC4  16.87,31.44 0 top
IC5  34.75,26.25 180 top
IC6  13.8,21.7 0 top
J1  16.75,46.25 180 top
J2  4,43 270 top
J3  45,7 90 top
JP1  34.8,43.1 90 top
Q1  19.18,4.02 0 top
R1  23.93,26.4 90 top
R2  24.57,26.4 90 top
R3  18.55,25.35 0 top
R4  22.75,15.3 90 top
R5  20.9,15.25 90 top
R6  20.3,15.25 90 top
R7  30.4,20.4 90 top
R8  29.75,20.4 270 top
R9  38.1,48.4 270 top
R10  31.55,17.65 180 top
R11  34.75,31.25 90 top
R12  37,5.5 90 top
R13  32.5,5.5 90 top
R14  30,5.5 90 top
R15  34.5,5.5 90 top
RESET  33.99,13.5 0 top
USB_BOOT  14.55,13.7 180 top

### Tracks (layer width: path | path; a pad name or v marks a point on that pad's centre or on a via)
!QSPI_SS!
  Top 0.102: IC4.1 11.95,33.34 11.3,32.7 11.3,28.7 13,27 17.4,27 18.8,25.6 R3.2 20.07,24.08 IC2.56
!RESET!
  Top 0.102: 29.75,11.88 30.38,11.25 30.62,11.25 RESET.3 | 29.75,11.88 24.88,16.75 24.88,17.12 IC2.26 | C17.1 31.88,18.75 31.88,17.75 R10.1 31.88,17.62 31.88,16.5 33.12,15.25 | 33.12,15.25 37.12,11.25 RESET.4 37.25,11.12 38.75,9.62 42.38,9.62 J3.4 | 33.12,15.25 29.75,11.88
+1.8_FT
  Top 0.102: C11.1 22.25,26.38 22.25,25.88 22.88,25.25 22.88,24.12 IC2.50 | C12.1 23.9,15.65 23.9,16 23.75,16.15 23.75,17.12 IC2.23 | C13.1 25.25,26.38 25.25,24.88 24.88,24.5 24.88,24.12 IC2.45 24.88,24
  Top 0.305: IC2.23 23.67,17.77 23.9,18 24.8,18 25.07,18.27 25.07,22.9 24.88,23.1 24.88,23.3 | 24.88,23.3 24.88,24 | IC2.50 22.87,23.43 23,23.3 24.88,23.3
+3V3  (via drill 0.2)
  Top 0.102: 28.8,47.38 28,47.38 27.9,47.38 27.5,47.38 27.41,47.39 IC3.4 | 29.5,47.12 v29.5,47.1 | C3.1 25.25,38.5 27.38,40.62 IC3.2 27.5,40.5 27.88,40.5 28.25,40.12 v28.25,40.1 | 20.38,33.38 20.38,34.88 C16.1 | C5.1 26.38,26.5 26,26.5 C4.1 25.88,26.38 25.88,25.75 25.75,25.62 25.75,24.62 | 25.25,24.12 25.75,24.62 | 25.75,24.62 26.12,25 C27.1 | 25.25,24.12 25.62,24.12 IC2.43 25.75,24 25.75,23.25 | 25.25,24.12 IC2.44 | 23.25,24.12 23.25,25.9 | 23.25,25.9 23.25,26.38 C6.1 23.12,26.5 22.75,26.5 C7.1 22.67,26.13 v22.85,25.95 22.9,25.9 23.25,25.9 | 23.25,24.12 23.62,24.12 IC2.48 | 23.25,24.12 IC2.49 | C10.1 23.25,15.8 23.25,17.12 IC2.22 23.27,17.98 23.25,18.05 v23.05,18.25 | C15.1 18.12,19.62 19.5,19.62 IC2.10 20.5,19.62 v20.5,19.65 | C9.1 27.88,19.62 26.62,19.62 IC2.33 26.5,19.62 25.7,19.62 v25.7,19.75 | C14.1 18.38,23.25 19.5,23.25 IC2.1 19.62,23.25 20.5,23.25 v20.5,23.15 | C26.1 16.38,24 16.41,24.09 | v19.75,14.9 19.75,14.88 20.25,14.88 R6.1 20.38,15 20.88,15 R5.1 | v28.12,23.75 28,23.62 28,23.25 C8.1 | R10.2 31.25,17.6 v30.1,17.6 | 25.75,23.25 25.5,23.25 v25.5,23.15 | 25.75,23.25 26.5,23.25 IC2.42 | D1.+ 37.62,2.25 42.38,7 J3.2 | 20.38,33.38 18.75,33.38 v18.65,33.45 | 20.38,33.38 IC4.8
  Top 0.2: IC6.23 v16,24.5 16.41,24.09 | C25.1 14.55,25.05 v14.6,25 14.6,24.4 IC6.24 | v25.25,47.85 25.9,47.85 | 25.9,47.85 26,47.85 | 26,47.85 26.25,47.85 26.71,47.39 27,47.39 | 27,47.39 27.41,47.39 27.12,47.1 26.1,47.1 | v25.25,47.1 26.1,47.1 | v26,46.35 26,47 26.1,47.1 | v27,46.35 27,47.39 | v28,46.35 28,47.27 27.9,47.38 | v29,46.35 28.8,46.55 28.8,47.1 | 28.8,47.1 28.8,47.38 | v29.5,47.1 28.8,47.1 | v29.5,47.85 28.85,47.85 28.8,47.9 | 28.8,47.9 25.95,47.9 25.9,47.85 | v26,48.6 26,47.85 | v27,48.6 27,47.39 | v28,48.6 28,47.38 | v29,48.6 28.8,48.4 28.8,47.9
  pour Route15: -2,52 51,52 51,-2 -2,-2
+5V
  Top 0.102: 32.72,33.41 32.72,33.43 33.1,33.6 33.5,33.62 33.62,33.62 IC1.1 | 33.1,33.38 33.12,33.38 33.2,33.7 | 33.62,35.7 33.62,35.75 IC1.6
  Top 0.2: 18.31,43.41 18.22,43.5 J1.1 | IC1.6 33.62,35.7 33.2,35.7
  Top 0.254: 33.3,33.41 32.72,33.41 C1.1
  Top 0.813: 18.31,43.41 18.31,42.69 19.25,41.75 21,41.75 21.5,42.25 28.5,42.25 29.69,41.06 IC3.3 29.7,38.8 C2.1 32.2,35.7 33.2,35.7 | 33.2,35.7 33.2,35.61 | 33.2,35.7 33.2,33.7 | 33.1,33.6 33.1,33.38 33.1,31.68 IC5.3 32.02,30.6 C21.1
ADC0  (via drill 0.2)
  Top 0.102: v27.38,21.62 26.62,21.62 IC2.38 | v27.62,25 31.75,29.12 v33,29.12
  Bottom 0.102: v27.38,21.62 27.62,21.88 v27.62,25 | v33,29.12 33.5,29.62 33.5,38 JP1.2
ADC1  (via drill 0.2)
  Top 0.102: v25.75,22.12 26.5,22.12 IC2.39
  Bottom 0.102: v25.75,22.12 27,23.38 27,40.69 33.07,46.76 33.99,46.76 34.65,46.1 34.65,41.68 JP1.4
ADC2  (via drill 0.2)
  Top 0.102: v28.38,22.62 28.25,22.5 26.62,22.5 IC2.40
  Bottom 0.102: v28.38,22.62 29.12,23.38 29.12,42.53 33.15,46.55 33.91,46.55 34.44,46.02 34.44,44.01 JP1.6
ADC3  (via drill 0.2)
  Top 0.102: v30.12,26.88 27.62,24.38 27.62,23.5 27,22.88 26.62,22.88 IC2.41
  Bottom 0.102: v30.12,26.88 32.5,29.25 32.5,44.62 33.5,45.62 JP1.8
GND  (via drill 0.2)
  Top 0.102: 12.39,25.92 C24.2 | C9.2 28.5,19.62 29.5,20.62 29.75,20.62 R8.1 29.75,21.2 | 29.75,23.12 28.5,23.12 C8.2 | 29.75,23.12 30.25,22.62 C23.2 | 29.75,23.12 29.75,21.2 | C15.2 17.5,19.5 16.88,19.5 16.5,19.12 14.62,19.12 IC6.13 14.5,19.12 IC6.13 | C27.2 26.25,25.62 26.88,26.25 26.88,26.62 26.5,27 C5.2 26.38,27 26,27 | C14.2 17.75,23.25 17,24 C26.2 16.88,24 | C11.2 22.25,27 22.62,27 C7.2 22.75,27 | 22.75,27 23.12,27 C6.2 | C13.2 25.38,27 25.88,27 C4.2 26,27 | C10.2 23.5,15.12 24,15.12 C12.2 24,15 24.75,15 v24.8,14.9 | C19.2 14.75,7.25 14.75,8.38 17.75,11.38 USB_BOOT.1 | v24.6,7.25 24,7.25 C20.1 | 30.5,33.38 30.38,33.38 v30.3,33.35 30.5,33.38 | 30.5,33.38 30.88,33.38 C1.2 | C16.2 20.88,34.88 20.88,34.38 22.75,32.5 22.75,27.5 v22.8,27.45 22.75,27.38 22.75,27 | v30,6.35 R14.2 | v32.5,6.35 R13.2 | v34.5,6.35 R15.2 | v37,6.35 R12.2 | 13.5,19 IC6.E25 | 26,27 26,27.38 v25.9,27.45 | IC6.11 12.25,19.38 13,18.62 13.05,18.62 | IC6.B25 13.88,19.38 14.12,19.12 IC6.F25 | v13.8,25 13.88,24.88 13.88,24 IC6.A25 13.88,23.88 13.88,21.75 IC6.25 | IC2.19 22,17.25 22,19.38 IC2.57 | C17.2 33.25,18.88 33.25,19.12 33.91,19.79 v33.95,19.75 | C3.2 22.62,38.5 v22.55,38.6 | C2.2 28,38.5 28,37.75 27.88,37.62 v27.8,37.6 | 30.5,33.38 C21.2 | IC1.2 34.38,33.5 34.38,32.62 v34.3,32.6 | C22.2 37,35.5 37.25,35.5 38,36.25 v38.05,36.35 | IC3.1 25.12,40.62 25.88,40.62 26,40.75 v26.05,40.85 | IC4.4 13.38,29.5 14.88,29.5 v14.9,29.45 | J1.5 15.38,43.5 15.38,43.12 14.88,42.62 v14.8,42.6 | v29.3,21.2 29.75,21.2
  Top 0.2: v11.8,26.1 11.95,25.95 C24.2 | v13.8,18.4 13.5,18.4 13.5,19 13.5,19.01 | 14.1,18.4 v14.4,18.4 14.54,18.54 IC6.13 | 14.1,18.4 v13.8,18.4 | IC6.D25 14.07,24.73 v13.8,25 | IC6.C25 13.53,24.73 v13.8,25 | IC6.F25 14.1,18.99 14.1,18.4 | IC6.12 13.05,18.62 13.05,18.5 13.15,18.4 v13.8,18.4 | v14,26.45 14,25.65 C25.2 14.05,25.25 v13.8,25 | C26.2 17,24.05 v17.6,24.05
  Top 0.406: v21.2,22.5 IC2.57 | v24.4,22.75 24.4,21.96 IC2.57 | v24.4,18.7 24.4,19.2 23.07,20.53 IC2.57 | v21.2,18.7 21.2,18.76 IC2.57
  pour Route2: -1,51 50,51 50,-1 -1,-1
GPIO0  (via drill 0.2)
  Top 0.102: v11.5,23.5 12.12,23.5 IC6.3
  Bottom 0.102: v11.5,23.5 9.12,25.88 9.12,37.88 J2.4
GPIO1  (via drill 0.2)
  Top 0.102: v11.12,23 12.12,23 IC6.4
  Bottom 0.102: v11.12,23 8.88,25.25 8.88,35.62 6.62,37.88 J2.6
GPIO2  (via drill 0.2)
  Top 0.102: v10.75,22.5 12.12,22.5 IC6.5
  Bottom 0.102: v10.75,22.5 8.62,24.62 8.62,33.38 6.62,35.38 J2.8
GPIO3  (via drill 0.2)
  Top 0.102: v8.88,23.5 10.38,22 12.12,22 IC6.6
  Bottom 0.102: v8.88,23.5 8.38,24 8.38,31 6.62,32.75 J2.10
GPIO4  (via drill 0.2)
  Top 0.102: v10.25,21.5 12.12,21.5 IC6.7
  Bottom 0.102: v10.25,21.5 8.12,23.62 8.12,28.75 6.62,30.25 J2.12
GPIO5  (via drill 0.2)
  Top 0.102: v8.12,22.88 10,21 12.12,21 IC6.8
  Bottom 0.102: v8.12,22.88 7.88,23.12 7.88,26.5 6.62,27.75 J2.14
GPIO6  (via drill 0.2)
  Top 0.102: v9.62,20.5 12.12,20.5 IC6.9
  Bottom 0.102: v9.62,20.5 7.62,22.5 7.62,24.12 6.62,25.12 J2.16
GPIO7
  Top 0.102: IC6.10 12.12,20 9.25,20 6.62,22.62 J2.18
GPIO8  (via drill 0.2)
  Top 0.102: IC6.2 12.12,24 6.38,24 5.5,23.12 5.5,21.25 6.5,20.25 J2.20 | v17.62,18.5 18.38,19.25 19.5,19.25 IC2.11
  Bottom 0.102: v17.62,18.5 13.12,14 5.5,14 5.5,19.12 6.5,20.12 J2.20
GPIO9  (via drill 0.2)
  Top 0.102: v16.75,23.38 15.5,23.38 IC6.22 | v20.38,18.88 19.62,18.88 IC2.12
  Bottom 0.102: v20.38,18.88 21,19.5 21,20.5 18,23.5 16.88,23.5 v16.75,23.38 16.75,23.5 13.75,23.5 7.88,17.62 6.57,17.62 J2.22
GPIO10
  Top 0.102: IC2.13 19.62,18.38 20.12,18.38 20.25,18.25 20.25,17.88 19.5,17.12 8.62,17.12 6.62,15.12 J2.24
GPIO11
  Top 0.102: IC2.14 19.5,18 8.5,18 6.62,16.12 6.12,16.12 5.5,15.5 5.5,13.62 6.5,12.62 J2.26
GPIO12  (via drill 0.2)
  Top 0.102: IC2.15 20.38,17.12 20.38,15.62 R6.2 20.25,15.5 19,15.5 13.5,10 6.62,10 J2.28 | IC1.4 35,36 34,37 32.25,37 30.38,38.88 30.38,41.25 v23.62,48
  Bottom 0.102: v23.62,48 5.25,48 5.25,11.25 6.5,10 J2.28
GPIO13  (via drill 0.2)
  Top 0.102: IC2.16 20.88,17.12 20.88,15.62 R5.2 21,15.5 21.38,15.12 21.38,14.88 21,14.5 19.25,14.5 11.38,6.62 11.38,3 12.12,2.25 D2.+ | IC1.3 35,32.38 v35.38,32 | D2.+ v30.5,3.25 | D2.+
  Bottom 0.102: v35.38,32 35.12,31.75 35.12,7.88 v30.5,3.25
GPIO14  (via drill 0.2)
  Top 0.102: v21.5,15.62 21.25,15.88 21.25,17.12 IC2.17 | v28.75,8.38 31.38,5.75 31.38,2.88 D3.+
  Bottom 0.102: v28.75,8.38 v21.5,15.62
GPIO15  (via drill 0.2)
  Top 0.102: v21.88,16.38 21.75,16.5 21.75,17.12 IC2.18 | v33.62,2.25 D4.+
  Bottom 0.102: v21.88,16.38 29.25,9 29.25,3.5 30.5,2.25 v33.62,2.25
GPIO16  (via drill 0.2)
  Top 0.102: v31.62,14.38 27.62,14.38 25.25,16.75 25.25,17.12 IC2.27 | v34.62,14.38 39.62,14.38 42.38,17.12 J3.10
  Bottom 0.102: v34.62,14.38 v31.62,14.38
GPIO17  (via drill 0.2)
  Top 0.102: J3.12 42.38,19.62 39.9,17.15 v32.45,17.15 | v30.88,17.15 25.7,17.15 IC2.28
  Bottom 0.102: v32.45,17.15 v30.88,17.15
GPIO18  (via drill 0.2)
  Top 0.102: v30.75,18 26.62,18 IC2.29 | v34.4,18 38.25,18 42.38,22.12 J3.14
  Bottom 0.102: v34.4,18 v30.75,18
GPIO19  (via drill 0.2)
  Top 0.102: v30.88,18.62 30.75,18.5 26.62,18.5 IC2.30 | v36.25,18.62 v34.38,18.62
  Bottom 0.102: v34.38,18.62 v30.88,18.62 | v36.25,18.62 42.38,24.75 J3.16
GPIO20  (via drill 0.2)
  Top 0.102: v30.75,19.25 30.38,18.88 26.62,18.88 IC2.31 | v37.62,33 42.38,28.25 42.38,27.38 J3.18
  Bottom 0.102: v30.75,19.25 34.62,19.25 34.62,32.25 35.38,33 v37.62,33
GPIO21  (via drill 0.2)
  Top 0.102: v28.88,19.38 28.75,19.25 26.62,19.25 IC2.32
  Bottom 0.102: v28.88,19.38 29.62,18.62 29.62,15.03 30.05,14.6 31.2,14.6 31.4,14.8 31.8,14.8 32.8,15.8 34,15.8 34.88,16.68 34.88,32.04 35.22,32.38 39.94,32.38 J3.20
GPIO22  (via drill 0.2)
  Top 0.102: v27.38,20.12 26.62,20.12 IC2.34
  Route15 0.102: J3.22 32.28,22.22 32.28,20.77 31.64,20.12 v27.38,20.12
GPIO23  (via drill 0.2)
  Top 0.102: IC2.35 27.14,20.43 27.22,20.5 27.53,20.5 27.54,20.5 28.5,20.5 v28.75,20.75
  Route15 0.102: J3.24 28.75,21.23 v28.75,20.75
GPIO24  (via drill 0.2)
  Top 0.102: v27.88,20.88 26.62,20.88 IC2.36 | v32,37.88 33.12,39 40.88,39 42.38,37.5 J3.26
  Bottom 0.102: v27.88,20.88 29.62,22.62 29.62,35.5 v32,37.88
GPIO25  (via drill 0.2)
  Top 0.102: v29,22.62 27.5,21.12 27.25,21.12 27.12,21.25 26.62,21.25 IC2.37 | v32,38.5 32.25,38.5 33.38,39.62 42,39.62 42.38,40 J3.28
  Bottom 0.102: v29,22.62 29.38,23 29.38,35.88 v32,38.5
LVL0
  Top 0.102: IC6.21 15.5,22.88 19.5,22.88 IC2.2
LVL1
  Top 0.102: IC6.20 15.5,22.5 19.5,22.5 IC2.3
LVL2
  Top 0.102: IC6.19 15.5,22 19.5,22 IC2.4
LVL3
  Top 0.102: IC6.18 15.5,21.5 19.38,21.5 19.5,21.62 IC2.5
LVL4
  Top 0.102: IC6.17 15.5,21 19,21 19.25,21.25 19.5,21.25 IC2.6
LVL5  (via drill 0.2)
  Top 0.102: v16.5,20.5 15.5,20.5 IC6.16 | v20.38,20.5 20.12,20.75 19.62,20.75 IC2.7
  Bottom 0.102: v20.38,20.5 v16.5,20.5
LVL6
  Top 0.102: IC6.15 15.5,20 17.12,20 17.5,20.38 19.5,20.38 IC2.8
LVL7
  Top 0.102: IC6.14 15.5,19.5 16.5,19.5 16.75,19.75 17.25,19.75 17.5,20 19.5,20 IC2.9
N$1
  Top 0.102: IC2.20 22.47,16.37 22,15.9 22,10.5 18.68,7.18 C19.1 15.21,4.8 Q1.1
N$2
  Top 0.102: R4.1 22.75,10.45 23.49,9.71 C20.2 23.49,4.46 Q1.2
N$3
  Top 0.102: D1.- R12.1
N$4
  Top 0.102: R14.1 30,4.38 29.5,3.88 D2.-
N$5  (via drill 0.2)
  Top 0.102: v18.38,24.25 18.38,25.25 R3.1 | USB_BOOT.4 11.38,16 17.75,16 USB_BOOT.3
  Bottom 0.102: v18.38,24.25 21.62,21 21.62,18.5 19.12,16 17.88,16 USB_BOOT.3
N$6
  Top 0.102: R13.1 32.5,4.38 32,3.88 D3.-
N$7
  Top 0.102: IC2.21 22.87,16.27 22.7,16.1 22.7,15.61 R4.2
N$8
  Top 0.102: D4.- R15.1
N$9  (via drill 0.2)
  Top 0.102: R9.2 38,48.12 38,47.62 36.12,45.75 JP1.7 36.12,45.62 36.12,43.12 JP1.5 36.12,43 36.12,40.62 JP1.3 | v31.27,20.73 30.47,20.73 R7.2
  Bottom 0.102: v31.27,20.73 33.88,23.32 33.88,35.88 36,38 JP1.1 36.12,38.12 36.12,40.5 JP1.3
N$11
  Top 0.102: R8.2 R7.1
QSPI_CLK
  Top 0.102: IC2.52 22.07,25.13 21.1,26.1 21.1,27.6 21.8,28.3 21.8,30.5 21.5,30.8 IC4.6
QSPI_SD0
  Top 0.102: IC2.53 21.67,24.93 20.47,26.13 IC4.5
QSPI_SD1
  Top 0.102: IC2.55 20.87,24.52 17.89,27.5 13.2,27.5 11.8,28.9 11.8,31.8 12.1,32.1 13.24,32.1 IC4.2
QSPI_SD2
  Top 0.102: IC2.54 21.27,24.73 15.2,30.8 IC4.3
QSPI_SD3
  Top 0.102: IC2.51 22.47,25.33 21.6,26.2 21.6,27.4 22.4,28.2 22.4,31.3 21.62,32.08 IC4.7
RVAL
  Top 0.102: 37,31.12 36.62,31.5 R11.2 | 37,31.12 37,32.75 | 37,32.75 C22.1 | 37,31.12 IC5.1 | 37,32.75 34.38,35.38 34.38,35.62 IC1.5
SWCLK  (via drill 0.2)
  Top 0.102: IC2.24 24.1,17.15 24.1,16.3 28.3,12.1 28.3,10.9 31.6,7.6 v37.9,7.6
  Bottom 0.102: v37.9,7.6 42.38,12.08 J3.6
SWDIO
  Top 0.102: IC2.25 24.5,17.12 24.5,16.48 29,11.97 29,11.1 31.6,8.5 31.8,8.3 43.17,8.3 43.7,8.82 43.7,13.3 43.5,13.5 42.5,14.5 J3.8
USB_N
  Top 0.229: R2.2 24.57,26.86 24.38,27.05 24.38,34.56 17.3,41.64 17.3,42.4 17.4,42.5 J1.2
USB_P
  Top 0.229: R1.2 23.93,26.98 24,27.05 24,34.4 16.92,41.48 16.92,42.4 16.75,42.57 J1.3
USBD_N
  Top 0.229: IC2.46 24.47,24.96 24.43,24.96 24.43,25.8 24.57,25.93 R2.1
USBD_P
  Top 0.229: IC2.47 24.07,24.96 24.11,24.96 24.11,25.84 23.93,26.02 R1.1
V_SAMPLE
  Top 0.102: 38.25,48.68 38.25,48.72 R9.1 | 34.62,23.8 34.62,23.88 IC5.4 34.88,23.75 35,23.62 35.12,23.5
  Top 0.406: 38.1,48.68 38.25,48.68 43.82,48.68 47,45.5 47,24.2 46.3,23.5 35.12,23.5 | R11.1 35.25,30.5 35.25,24.37 IC5.4 | C23.1 30.35,23.8 34.62,23.8 34.68,23.8 | R9.1 37.35,49.4 11.9,49.4 10.7,48.2 10.7,26.1 12,24.8 12.3,24.8 | IC6.1 12.6,24.8 12.3,24.8 | C24.1 12.4,24.9 12.3,24.8

### Text on the board
tNames: vVCC v1 | (c) SjG | 13 | 14 | 15 | PWR